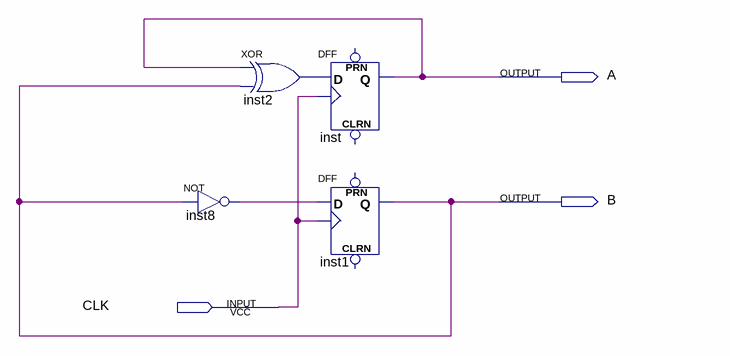
[diagram p0: schematic sheet]
// Quartus schematic DFF_Application.bdf as structural Verilog: 4 symbols, 3 pins
module DFF_Application (
  input  CLK,
  output A,
  output B
);

  wire inst2_out, inst8_out;

  not inst8 (inst8_out, B);
  xor inst2 (inst2_out, A, B);
  DFF inst (.CLK(CLK), .D(inst2_out), .Q(A));  // open: CLRN, PRN
  DFF inst1 (.CLK(CLK), .D(inst8_out), .Q(B));  // open: CLRN, PRN
endmodule
